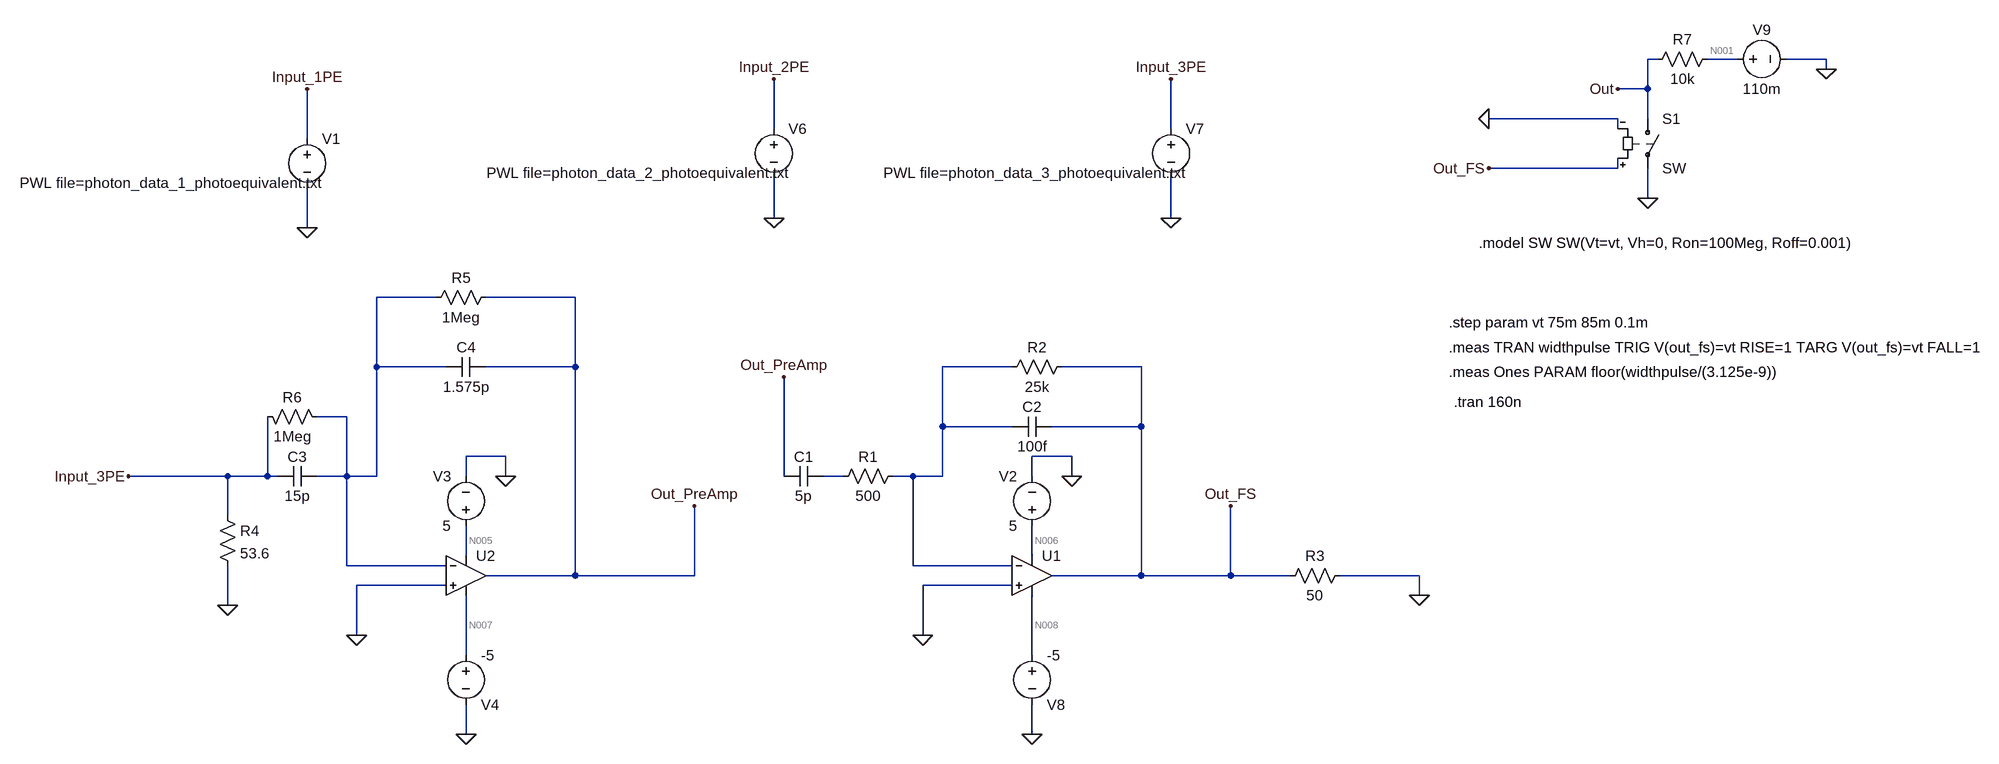
[diagram p0: schematic threshold_calculator.asc]
threshold_calculator.asc, the LTspice schematic file:
Version 4
SHEET 1 2920 856
WIRE 2128 -752 2112 -752
WIRE 2256 -752 2208 -752
WIRE 2400 -752 2336 -752
WIRE 2400 -736 2400 -752
WIRE 2112 -704 2112 -752
WIRE 2112 -704 2064 -704
WIRE 2064 -656 1856 -656
WIRE 2112 -656 2112 -704
WIRE 704 -640 704 -720
WIRE 1344 -640 1344 -720
WIRE 2064 -640 2064 -656
WIRE -48 -624 -48 -704
WIRE 2064 -576 2064 -592
WIRE 2064 -576 1856 -576
WIRE 2112 -528 2112 -576
WIRE 704 -496 704 -560
WIRE 1344 -496 1344 -560
WIRE -48 -480 -48 -544
WIRE 160 -368 64 -368
WIRE 384 -368 240 -368
WIRE 64 -256 64 -368
WIRE 176 -256 64 -256
WIRE 384 -256 384 -368
WIRE 384 -256 240 -256
WIRE 1088 -256 976 -256
WIRE 1296 -256 1168 -256
WIRE 16 -176 -32 -176
WIRE 976 -160 976 -256
WIRE 1088 -160 976 -160
WIRE 1296 -160 1296 -256
WIRE 1296 -160 1152 -160
WIRE 272 -112 208 -112
WIRE 1184 -112 1120 -112
WIRE -176 -80 -336 -80
WIRE -112 -80 -112 -176
WIRE -112 -80 -176 -80
WIRE -96 -80 -112 -80
WIRE 16 -80 16 -176
WIRE 16 -80 -32 -80
WIRE 64 -80 64 -256
WIRE 64 -80 16 -80
WIRE 208 -80 208 -112
WIRE 272 -80 272 -112
WIRE 720 -80 720 -240
WIRE 816 -80 784 -80
WIRE 928 -80 896 -80
WIRE 976 -80 976 -160
WIRE 976 -80 928 -80
WIRE 1120 -80 1120 -112
WIRE 1184 -80 1184 -112
WIRE -176 -16 -176 -80
WIRE 208 48 208 0
WIRE 1120 48 1120 0
WIRE 16 64 16 -80
WIRE 176 64 16 64
WIRE 928 64 928 -80
WIRE 1088 64 928 64
WIRE 384 80 384 -256
WIRE 384 80 240 80
WIRE 576 80 576 -32
WIRE 576 80 384 80
WIRE 1296 80 1296 -160
WIRE 1296 80 1152 80
WIRE 1440 80 1440 -32
WIRE 1440 80 1296 80
WIRE 1536 80 1440 80
WIRE 1744 80 1616 80
WIRE 176 96 32 96
WIRE 1088 96 944 96
WIRE 1744 112 1744 80
WIRE -176 128 -176 64
WIRE 32 176 32 96
WIRE 944 176 944 96
WIRE 208 208 208 112
WIRE 1120 208 1120 112
WIRE 208 336 208 288
WIRE 1120 336 1120 288
FLAG -48 -480 0
FLAG -48 -704 Input_1PE
FLAG 704 -496 0
FLAG 704 -720 Input_2PE
FLAG 1344 -496 0
FLAG 1344 -720 Input_3PE
FLAG 2112 -528 0
FLAG 2400 -736 0
FLAG 2064 -704 Out
FLAG 1856 -656 0
FLAG 1856 -576 Out_FS
FLAG 1184 -80 0
FLAG 944 176 0
FLAG 1440 -32 Out_FS
FLAG 1744 112 0
FLAG 720 -240 Out_PreAmp
FLAG 208 336 0
FLAG 272 -80 0
FLAG 32 176 0
FLAG 576 -32 Out_PreAmp
FLAG -336 -80 Input_3PE
FLAG -176 128 0
FLAG 1120 336 0
SYMBOL voltage -48 -640 R0
WINDOW 3 -463 87 Left 2
WINDOW 123 0 0 Left 0
WINDOW 39 0 0 Left 0
SYMATTR Value PWL file=photon_data_1_photoequivalent.txt
SYMATTR InstName V1
SYMBOL voltage 704 -656 R0
WINDOW 3 -463 87 Left 2
WINDOW 123 0 0 Left 0
WINDOW 39 0 0 Left 0
SYMATTR Value PWL file=photon_data_2_photoequivalent.txt
SYMATTR InstName V6
SYMBOL voltage 1344 -656 R0
WINDOW 3 -463 87 Left 2
WINDOW 123 0 0 Left 0
WINDOW 39 0 0 Left 0
SYMATTR Value PWL file=photon_data_3_photoequivalent.txt
SYMATTR InstName V7
SYMBOL sw 2112 -672 R0
SYMATTR InstName S1
SYMBOL voltage 2240 -752 R270
WINDOW 0 32 56 VTop 2
WINDOW 3 -32 56 VBottom 2
WINDOW 123 0 0 Left 0
WINDOW 39 0 0 Left 0
SYMATTR InstName V9
SYMATTR Value 110m
SYMBOL res 2224 -768 R90
WINDOW 0 0 56 VBottom 2
WINDOW 3 32 56 VTop 2
SYMATTR InstName R7
SYMATTR Value 10k
SYMBOL res 912 -96 R90
WINDOW 0 0 56 VBottom 2
WINDOW 3 32 56 VTop 2
SYMATTR InstName R1
SYMATTR Value 500
SYMBOL res 1184 -272 R90
WINDOW 0 0 56 VBottom 2
WINDOW 3 32 56 VTop 2
SYMATTR InstName R2
SYMATTR Value 25k
SYMBOL voltage 1120 16 R180
WINDOW 0 24 96 Left 2
WINDOW 3 24 16 Left 2
WINDOW 123 0 0 Left 0
WINDOW 39 0 0 Left 0
SYMATTR InstName V2
SYMATTR Value 5
SYMBOL OpAmps\\UniversalOpAmp1 1120 80 R0
SYMATTR InstName U1
SYMATTR Value2 Avol=750 GBW=358Meg Vos=0
SYMBOL res 1632 64 R90
WINDOW 0 0 56 VBottom 2
WINDOW 3 32 56 VTop 2
SYMATTR InstName R3
SYMATTR Value 50
SYMBOL cap 784 -96 R90
WINDOW 0 0 32 VBottom 2
WINDOW 3 32 32 VTop 2
SYMATTR InstName C1
SYMATTR Value 5p
SYMBOL cap 1152 -176 R90
WINDOW 0 0 32 VBottom 2
WINDOW 3 32 32 VTop 2
SYMATTR InstName C2
SYMATTR Value 100f
SYMBOL voltage 208 16 R180
WINDOW 0 24 96 Left 2
WINDOW 3 24 16 Left 2
WINDOW 123 0 0 Left 0
WINDOW 39 0 0 Left 0
SYMATTR InstName V3
SYMATTR Value 5
SYMBOL voltage 208 192 R0
WINDOW 0 24 96 Left 2
WINDOW 3 24 16 Left 2
WINDOW 123 0 0 Left 0
WINDOW 39 0 0 Left 0
SYMATTR InstName V4
SYMATTR Value -5
SYMBOL OpAmps\\UniversalOpAmp1 208 80 R0
SYMATTR InstName U2
SYMATTR Value2 Avol=750 GBW=358Meg Vos=0
SYMBOL cap -32 -96 R90
WINDOW 0 0 32 VBottom 2
WINDOW 3 32 32 VTop 2
SYMATTR InstName C3
SYMATTR Value 15p
SYMBOL cap 240 -272 R90
WINDOW 0 0 32 VBottom 2
WINDOW 3 32 32 VTop 2
SYMATTR InstName C4
SYMATTR Value 1.575p
SYMBOL res -192 -32 R0
SYMATTR InstName R4
SYMATTR Value 53.6
SYMBOL res 256 -384 R90
WINDOW 0 0 56 VBottom 2
WINDOW 3 32 56 VTop 2
SYMATTR InstName R5
SYMATTR Value 1Meg
SYMBOL res -128 -192 M90
WINDOW 0 0 56 VBottom 2
WINDOW 3 32 56 VTop 2
SYMATTR InstName R6
SYMATTR Value 1Meg
SYMBOL voltage 1120 192 R0
WINDOW 0 24 96 Left 2
WINDOW 3 24 16 Left 2
WINDOW 123 0 0 Left 0
WINDOW 39 0 0 Left 0
SYMATTR InstName V8
SYMATTR Value -5
TEXT 1800 -200 Left 2 !.tran 160n
TEXT 1840 -456 Left 2 !.model SW SW(Vt=vt, Vh=0, Ron=100Meg, Roff=0.001)
TEXT 1792 -328 Left 2 !.step param vt 75m 85m 0.1m
TEXT 1792 -248 Left 2 !.meas Ones PARAM floor(widthpulse/(3.125e-9))
TEXT 1792 -288 Left 2 !.meas TRAN widthpulse TRIG V(out_fs)=vt RISE=1 TARG V(out_fs)=vt FALL=1

The netlist it stands for:
* threshold_calculator.asc
V1 Input_1PE 0 PWL file=photon_data_1_photoequivalent.txt
V6 Input_2PE 0 PWL file=photon_data_2_photoequivalent.txt
V7 Input_3PE 0 PWL file=photon_data_3_photoequivalent.txt
S1 Out 0 Out_FS 0 SW
V9 N001 0 110m
R7 N001 Out 10k
R1 N003 N004 500
R2 Out_FS N003 25k
V2 N006 0 5
XU1 0 N003 N006 N008 Out_FS level1 Avol=750 GBW=358Meg Vos=0 En=0 Enk=0 In=0 Ink=0 Rin=500Meg  ; pins In+ In- V+ V- OUT
R3 0 Out_FS 50
C1 N004 Out_PreAmp 5p
C2 Out_FS N003 100f
V3 N005 0 5
V4 N007 0 -5
XU2 0 N002 N005 N007 Out_PreAmp level1 Avol=750 GBW=358Meg Vos=0 En=0 Enk=0 In=0 Ink=0 Rin=500Meg  ; pins In+ In- V+ V- OUT
C3 N002 Input_3PE 15p
C4 Out_PreAmp N002 1.575p
R4 Input_3PE 0 53.6
R5 Out_PreAmp N002 1Meg
R6 Input_3PE N002 1Meg
V8 N008 0 -5
.tran 160n
.model SW SW(Vt=vt, Vh=0, Ron=100Meg, Roff=0.001)
.step param vt 75m 85m 0.1m
.meas Ones PARAM floor(widthpulse/(3.125e-9))
.meas TRAN widthpulse TRIG V(out_fs)=vt RISE=1 TARG V(out_fs)=vt FALL=1
.lib UniversalOpAmp1.lib
.backanno
.end

* Results of the author's LTspice run, read from the files saved beside the schematic
* Operating Point (first step), zero values left out:
*   vt = 75 m
*   V(out) = 11 nV
*   V(n001) = 110 mV
*   V(n006) = 5 V
*   V(n008) = -5 V
*   V(n005) = 5 V
*   V(n007) = -5 V
*   I(R7) = 11 µA
*   I(S1) = -11 µA
*   I(V9) = -11 µA
*   I(V2) = -10 nA
*   I(V3) = -10 nA
*   I(V4) = 10 nA
*   I(V8) = 10 nA
*   Ix(u1:3) = 10 nA
*   Ix(u1:4) = -10 nA
*   Ix(u2:3) = 10 nA
*   Ix(u2:4) = -10 nA
* From the log:
*   Measurement: ones
*     step  floor(widthpulse/(3.125e-9))
*        1  2
*        2  2
*        3  2
*        4  2
*        5  2
*        6  2
*        7  2
*        8  2
*        9  2
*       10  2
*       11  2
*       12  2
*       13  2
*       14  2
*       15  2
*       16  2
*       17  2
*       18  2
*       19  1
*       20  1
*       21  1
*       22  1
*       23  1
*       24  1
*       25  1
*       26  1
*       27  1
*       28  1
*       29  1
*       30  1
*       31  1
*       32  1
*       33  1
*       34  1
*       35  1
*       36  1
*       37  1
*       38  1
*       39  1
*       40  1
*     ...
*   Measurement: widthpulse
*     step  widthpulse  FROM  TO
*        1  6.88742e-09  7.86513e-09  1.47525e-08
*        2  6.85171e-09  7.88141e-09  1.47331e-08
*        3  6.81579e-09  7.89784e-09  1.47136e-08
*        4  6.77973e-09  7.91435e-09  1.46941e-08
*        5  6.74356e-09  7.93087e-09  1.46744e-08
*        6  6.70713e-09  7.94751e-09  1.46546e-08
*        7  6.6705e-09  7.96431e-09  1.46348e-08
*        8  6.63373e-09  7.98117e-09  1.46149e-08
*        9  6.59674e-09  7.99809e-09  1.45948e-08
*       10  6.5596e-09  8.01511e-09  1.45747e-08
*       11  6.52222e-09  8.0323e-09  1.45545e-08
*       12  6.48459e-09  8.04957e-09  1.45342e-08
*       13  6.44687e-09  8.06687e-09  1.45137e-08
*       14  6.4089e-09  8.08433e-09  1.44932e-08
*       15  6.37067e-09  8.10193e-09  1.44726e-08
*       16  6.33221e-09  8.1196e-09  1.44518e-08
*       17  6.29366e-09  8.13733e-09  1.4431e-08
*       18  6.25481e-09  8.15525e-09  1.44101e-08
*       19  6.21564e-09  8.17329e-09  1.43889e-08
*       20  6.17632e-09  8.19144e-09  1.43678e-08
*       21  6.13686e-09  8.20962e-09  1.43465e-08
*       22  6.09697e-09  8.22803e-09  1.4325e-08
*       23  6.05691e-09  8.24656e-09  1.43035e-08
*       24  6.0167e-09  8.26512e-09  1.42818e-08
*       25  5.97609e-09  8.28388e-09  1.426e-08
*       26  5.93524e-09  8.30281e-09  1.4238e-08
*       27  5.8942e-09  8.32182e-09  1.4216e-08
*       28  5.85285e-09  8.34092e-09  1.41938e-08
*       29  5.81118e-09  8.36027e-09  1.41715e-08
*       30  5.76926e-09  8.37974e-09  1.4149e-08
*       31  5.72704e-09  8.39929e-09  1.41263e-08
*       32  5.68455e-09  8.41901e-09  1.41036e-08
*       33  5.64173e-09  8.43895e-09  1.40807e-08
*       34  5.59855e-09  8.45899e-09  1.40575e-08
*       35  5.55517e-09  8.47915e-09  1.40343e-08
*       36  5.51138e-09  8.49958e-09  1.4011e-08
*       37  5.46722e-09  8.52012e-09  1.39873e-08
*       38  5.42285e-09  8.54077e-09  1.39636e-08
*       39  5.37802e-09  8.56172e-09  1.39397e-08
*       40  5.33276e-09  8.58282e-09  1.39156e-08
*     ...